# EAGLE board dsp_board_dds_vga (EAGLE 9.6.2), part 1 of 2
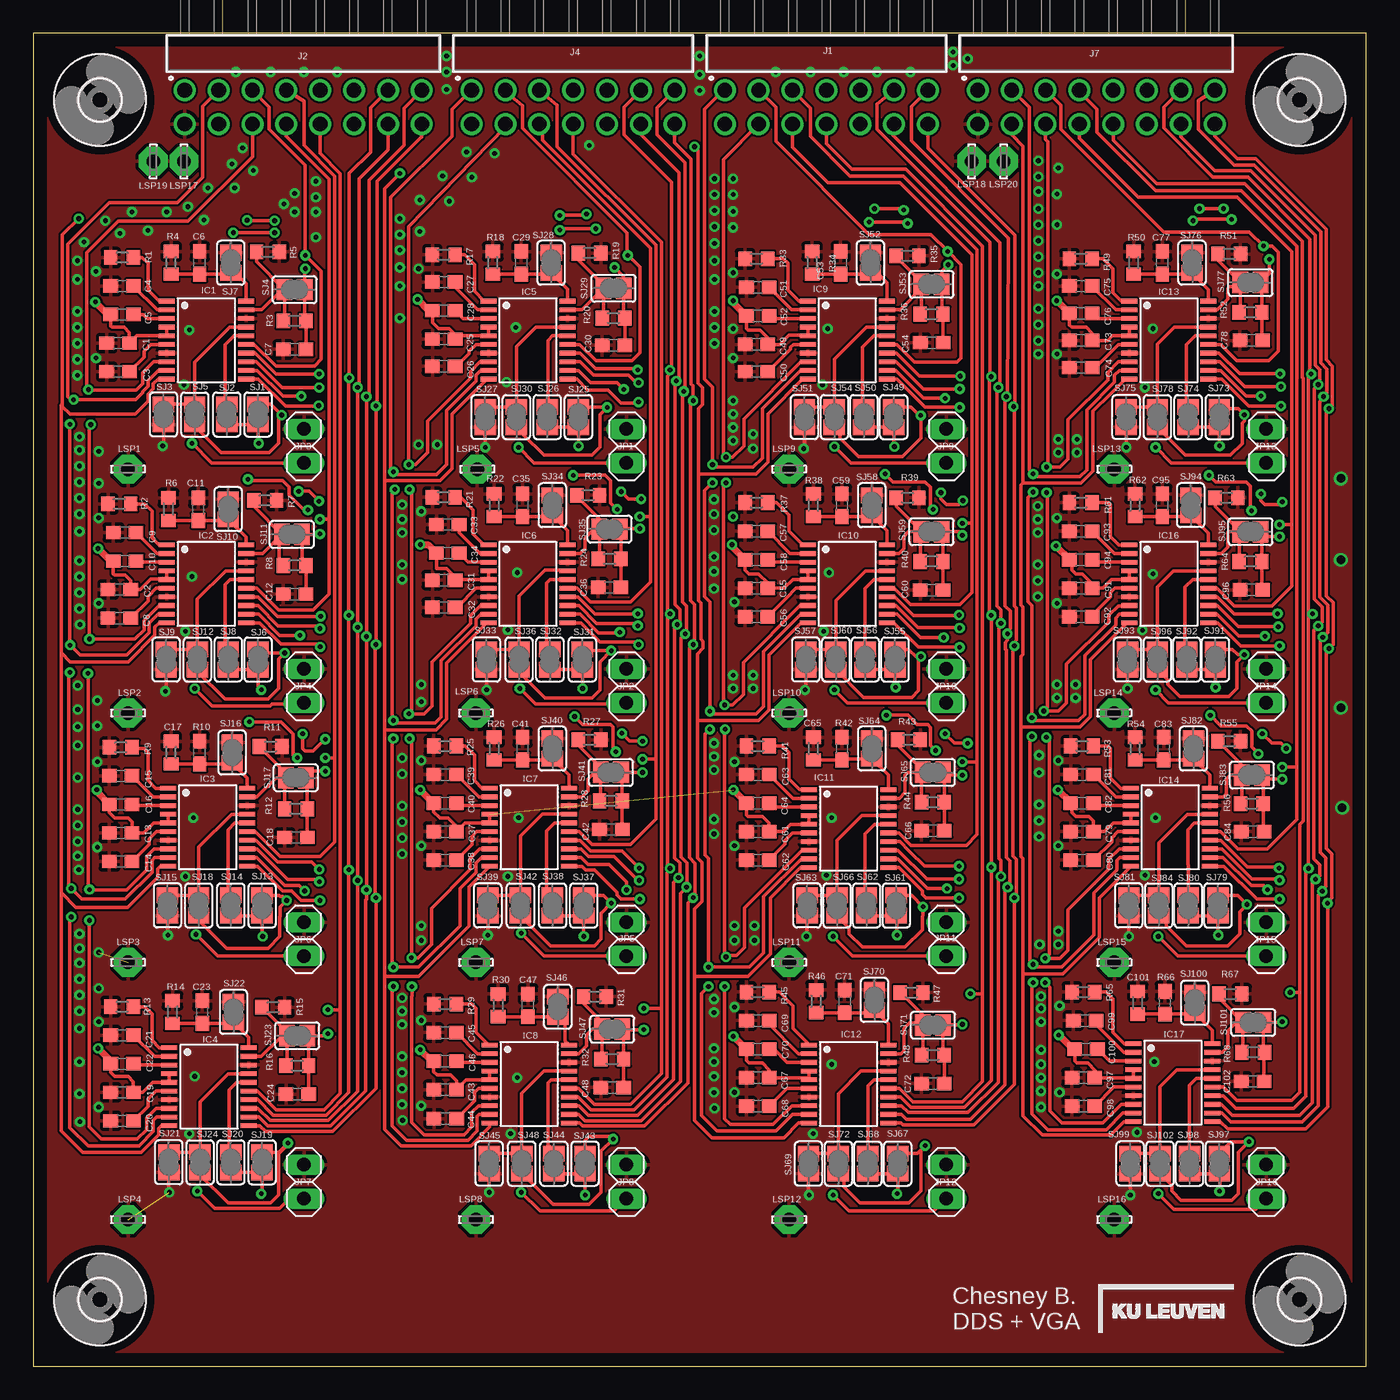
[diagram p8: board, top side]
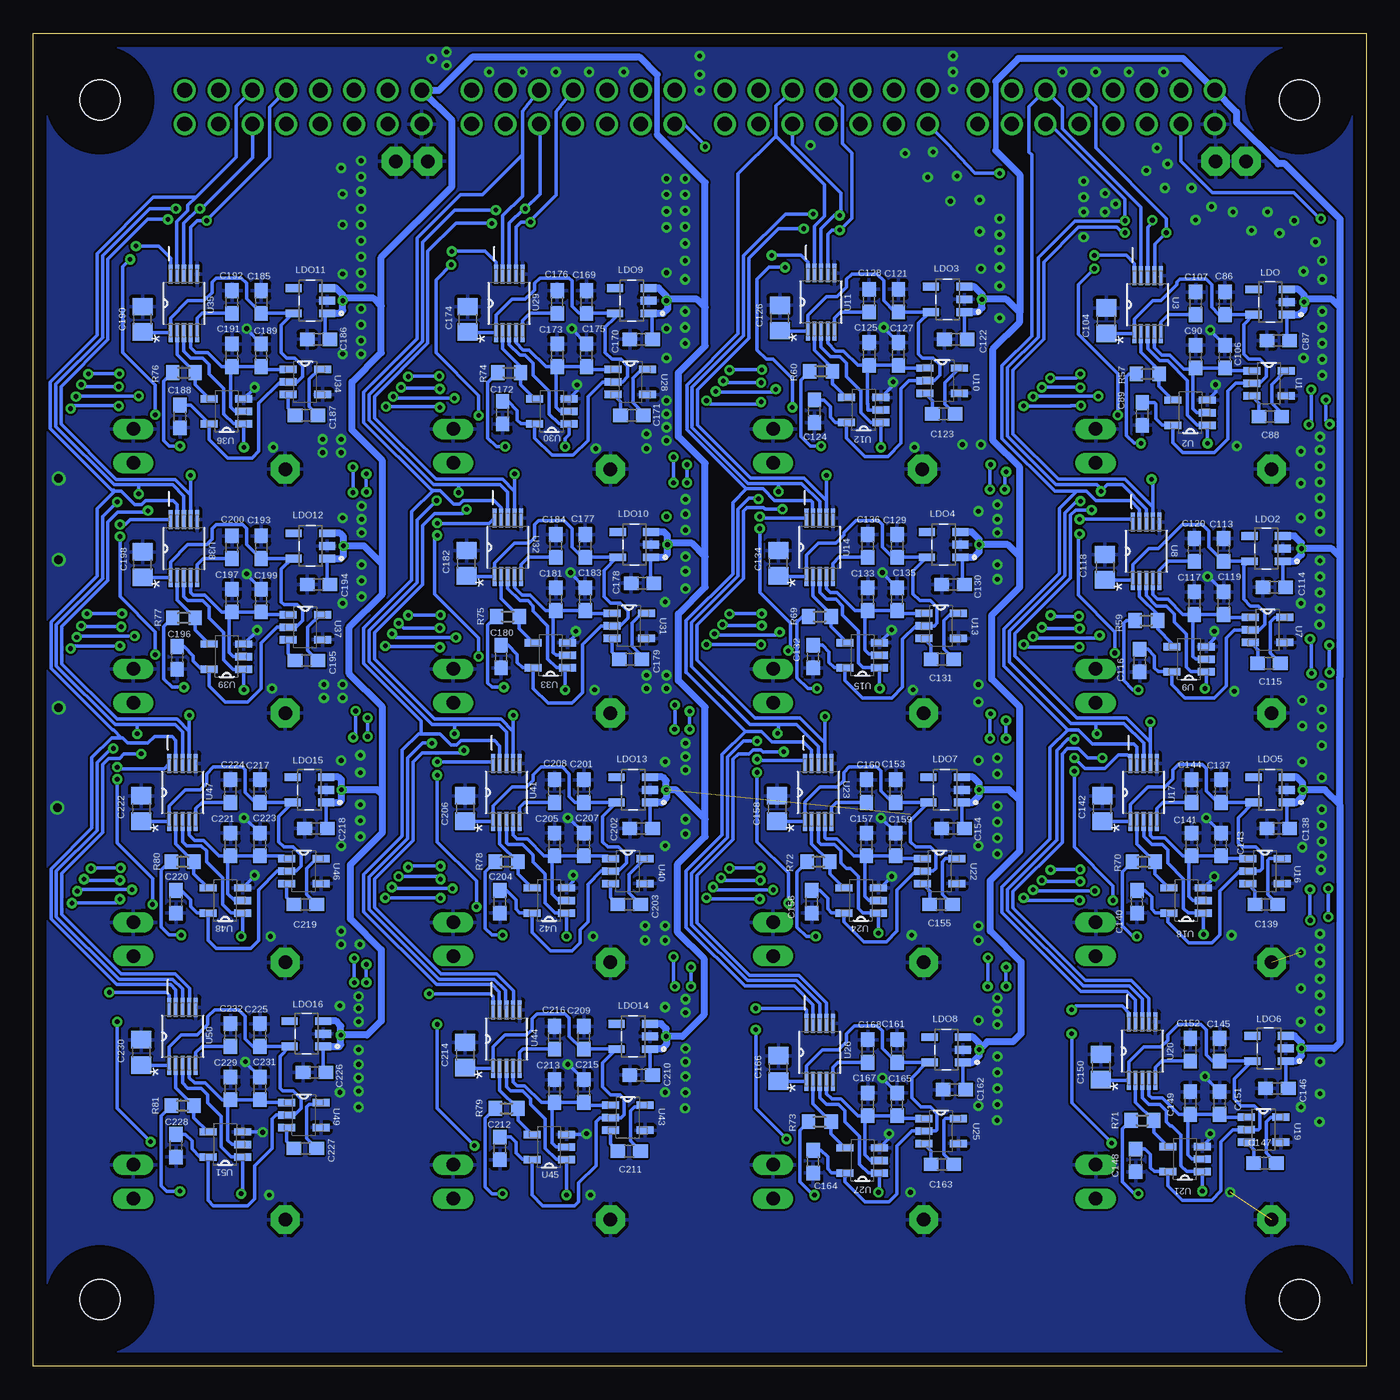
[diagram p9: board, bottom side, seen from below]

Size 100 x 100 mm. Coordinates in mm from the lower left corner, seen from the top.
Outline: 0,0 100,0 100,100 0,100 0,0
Copper layers (1*16): Top 0.035mm / dielectric 1.5mm / Bottom 0.035mm
Design rules "default": minimum track width 6mil, minimum drill 0.35mm, track to track 6mil, track to pad 6mil, pad to pad 6mil, via to via 6mil, smd to smd 6mil, copper to edge 40mil, drill to drill 6mil, minimum pad ring 10mil, minimum via ring 8mil, stop-mask expansion 4mil, vias tented up to drill 0mil, thermal gap 10mil

## Footprints (pad centres in the part's own frame; a part is rotated, then mirrored left to right if it is on the bottom)
C0603 = smd 1.1 x 1: 1 -0.85,0; 2 0.85,0
C0805 = smd 1.3 x 1.5: 1 -0.95,0; 2 0.95,0
3,0 = hole 3: 0,0
TSSOP20 = smd 0.35 x 1.2: 1 -2.275,-2.97; 2 -1.625,-2.97; 3 -0.975,-2.97; 4 -0.325,-2.97; 5 0.325,-2.97; 6 0.975,-2.97; 7 1.625,-2.97; 8 2.275,-2.97; 9 2.925,-2.97; 10 3.575,-2.97; 11 3.575,2.97; 12 2.925,2.97; 13 2.275,2.97; 14 1.625,2.97; 15 0.975,2.97; 16 0.325,2.97; 17 -0.325,2.97; 18 -0.975,2.97; 19 -1.625,2.97; 20 -2.275,2.97
61301421021 = drill 1.1: 1 7.62,2.77; 2 7.62,5.31; 3 5.08,2.77; 4 5.08,5.31; 5 2.54,2.77; 6 2.54,5.31; 7 0,2.77; 8 0,5.31; 9 -2.54,2.77; 10 -2.54,5.31; 11 -5.08,2.77; 12 -5.08,5.31; 13 -7.62,2.77; 14 -7.62,5.31
61301621021 = drill 1.1: 1 8.89,2.77; 2 8.89,5.31; 3 6.35,2.77; 4 6.35,5.31; 5 3.81,2.77; 6 3.81,5.31; 7 1.27,2.77; 8 1.27,5.31; 9 -1.27,2.77; 10 -1.27,5.31; 11 -3.81,2.77; 12 -3.81,5.31; 13 -6.35,2.77; 14 -6.35,5.31; 15 -8.89,2.77; 16 -8.89,5.31
1X02 = drill 1.016 long: 1 -1.27,0; 2 1.27,0
SOT95P280X145-5N = smd 0.59 x 1.21: 1 -0.95,-1.255; 2 0,-1.255; 3 0.95,-1.255; 4 0.95,1.255; 5 -0.95,1.255
LSP10 = drill 1.016 pad 2.159 octagon: MP 0,0
R0603 = smd 1 x 1.1: 1 -0.85,0; 2 0.85,0
SJ = smd 1.168 x 1.6: 1 -0.762,0; 2 0.762,0
SOT95P280X145-5N' = smd 1.27 x 0.559: 1 -1.295,0.94; 2 -1.295,0; 3 -1.295,-0.94; 4 1.295,-0.94; 5 1.295,0.94
SOP50P490X110-10N = smd 1.422 x 0.305: 1 -2.184,0.991; 2 -2.184,0.508; 3 -2.184,0; 4 -2.184,-0.508; 5 -2.184,-0.991; 6 2.184,-0.991; 7 2.184,-0.508; 8 2.184,0; 9 2.184,0.508; 10 2.184,0.991

## Placement (x,y rotation side)
C1  0.1u  [C0603]  6.36,76.76 180 top
C2  0.1u  [C0603]  6.46,58.27 180 top
C3  0.1u  [C0603]  6.36,74.62 180 top
C4  10n  [C0603]  6.66,81.04 180 top
C5  10n  [C0603]  6.66,78.9 180 top
C6  20p  [C0603]  12.48,82.78 90 top
C7  TBD  [C0603]  19.6,76.29 180 top
C8  0.1u  [C0603]  6.46,56.13 180 top
C9  10n  [C0603]  6.86,62.55 180 top
C10  10n  [C0603]  6.86,60.41 180 top
C11  20p  [C0603]  12.38,64.29 90 top
C12  TBD  [C0603]  19.6,57.93 180 top
C13  0.1u  [C0603]  6.56,40.01 180 top
C14  0.1u  [C0603]  6.56,37.87 180 top
C15  10n  [C0603]  6.56,44.29 180 top
C16  10n  [C0603]  6.56,42.15 180 top
C17  20p  [C0603]  12.48,46.03 90 top
C18  TBD  [C0603]  19.7,39.67 180 top
C19  0.1u  [C0603]  6.66,20.55 180 top
C20  0.1u  [C0603]  6.66,18.41 180 top
C21  10n  [C0603]  6.66,24.83 180 top
C22  10n  [C0603]  6.66,22.69 180 top
C23  20p  [C0603]  12.68,26.57 90 top
C24  TBD  [C0603]  19.8,20.41 180 top
C25  0.1u  [C0603]  30.79,77.06 180 top
C26  0.1u  [C0603]  30.79,75.02 180 top
C27  10n  [C0603]  30.79,81.34 180 top
C28  10n  [C0603]  30.79,79.2 180 top
C29  20p  [C0603]  36.61,82.78 90 top
C30  TBD  [C0603]  43.53,76.59 180 top
C31  0.1u  [C0603]  30.79,58.97 180 top
C32  0.1u  [C0603]  30.79,56.93 180 top
C33  10n  [C0603]  31.09,63.15 180 top
C34  10n  [C0603]  31.09,61.01 180 top
C35  20p  [C0603]  36.71,64.59 90 top
C36  TBD  [C0603]  43.23,58.43 180 top
C37  0.1u  [C0603]  30.89,40.11 180 top
C38  0.1u  [C0603]  30.89,37.97 180 top
C39  10n  [C0603]  30.89,44.39 180 top
C40  10n  [C0603]  30.89,42.25 180 top
C41  20p  [C0603]  36.71,46.33 90 top
C42  TBD  [C0603]  43.33,40.27 180 top
C43  0.1u  [C0603]  30.89,20.75 180 top
C44  0.1u  [C0603]  30.91,18.57 180 top
C45  10n  [C0603]  30.89,25.03 180 top
C46  10n  [C0603]  30.89,22.89 180 top
C47  20p  [C0603]  37.11,27.07 90 top
C48  TBD  [C0603]  43.43,20.91 180 top
C49  0.1u  [C0603]  54.25,76.66 180 top
C50  0.1u  [C0603]  54.25,74.62 180 top
C51  10n  [C0603]  54.35,80.94 180 top
C52  10n  [C0603]  54.35,78.8 180 top
C53  20p  [C0603]  60.57,82.78 90 top
C54  TBD  [C0603]  67.41,76.79 180 top
C55  0.1u  [C0603]  54.25,58.37 180 top
C56  0.1u  [C0603]  54.25,56.23 180 top
C57  10n  [C0603]  54.25,62.65 180 top
C58  10n  [C0603]  54.25,60.51 180 top
C59  20p  [C0603]  60.67,64.59 90 top
C60  TBD  [C0603]  67.39,58.23 180 top
C61  0.1u  [C0603]  54.35,40.11 180 top
C62  0.1u  [C0603]  54.35,37.97 180 top
C63  10n  [C0603]  54.35,44.39 180 top
C64  10n  [C0603]  54.35,42.25 180 top
C65  20p  [C0603]  60.67,46.33 90 top
C66  TBD  [C0603]  67.49,40.17 180 top
C67  0.1u  [C0603]  54.35,21.65 180 top
C68  0.1u  [C0603]  54.35,19.51 180 top
C69  10n  [C0603]  54.35,25.93 180 top
C70  10n  [C0603]  54.35,23.79 180 top
C71  20p  [C0603]  60.87,27.37 90 top
C72  TBD  [C0603]  67.49,21.21 180 top
C73  0.1u  [C0603]  78.58,76.96 180 top
C74  0.1u  [C0603]  78.58,74.92 180 top
C75  10n  [C0603]  78.58,81.04 180 top
C76  10n  [C0603]  78.58,79 180 top
C77  20p  [C0603]  84.7,82.78 90 top
C78  TBD  [C0603]  91.38,76.96 180 top
C79  0.1u  [C0603]  78.68,40.11 180 top
C80  0.1u  [C0603]  78.68,37.97 180 top
C81  10n  [C0603]  78.68,44.39 180 top
C82  10n  [C0603]  78.68,42.25 180 top
C83  20p  [C0603]  84.8,46.33 90 top
C84  TBD  [C0603]  91.48,40.11 180 top
C86  0.1u  [C0603]  10.6,79.74 270 bottom
C87  1u  [C0603]  6.6,76.94 0 bottom
C88  1u  [C0603]  7.2,71.24 0 bottom
C89  1u  [C0603]  16.8,71.44 90 bottom
C90  1u  [C0603]  12.8,75.74 270 bottom
C91  0.1u  [C0603]  78.58,58.37 180 top
C92  0.1u  [C0603]  78.58,56.23 180 top
C93  10n  [C0603]  78.58,62.65 180 top
C94  10n  [C0603]  78.58,60.51 180 top
C95  20p  [C0603]  84.7,64.59 90 top
C96  TBD  [C0603]  91.38,58.25 180 top
C97  0.1u  [C0603]  78.78,21.65 180 top
C98  0.1u  [C0603]  78.78,19.51 180 top
C99  10n  [C0603]  78.88,25.93 180 top
C100  10n  [C0603]  78.98,23.79 180 top
C101  20p  [C0603]  84.9,27.27 90 top
C102  TBD  [C0603]  91.48,21.37 180 top
C104  10u  [C0805]  19.5,78.44 90 bottom
C106  0.1u  [C0603]  10.6,75.74 90 bottom
C107  1u  [C0603]  12.8,79.74 90 bottom
C113  0.1u  [C0603]  10.7,61.24 270 bottom
C114  1u  [C0603]  6.9,58.44 0 bottom
C115  1u  [C0603]  7.3,52.74 0 bottom
C116  1u  [C0603]  17,52.94 90 bottom
C117  1u  [C0603]  12.9,57.24 270 bottom
C118  10u  [C0805]  19.6,59.94 90 bottom
C119  0.1u  [C0603]  10.7,57.24 90 bottom
C120  1u  [C0603]  12.9,61.24 90 bottom
C121  0.1u  [C0603]  35.1,79.94 270 bottom
C122  1u  [C0603]  30.8,77.04 0 bottom
C123  1u  [C0603]  31.7,71.44 0 bottom
C124  1u  [C0603]  41.4,71.64 90 bottom
C125  1u  [C0603]  37.3,75.94 270 bottom
C126  10u  [C0805]  44,78.64 90 bottom
C127  0.1u  [C0603]  35.1,75.94 90 bottom
C128  1u  [C0603]  37.3,79.94 90 bottom
C129  0.1u  [C0603]  35.2,61.54 270 bottom
C130  1u  [C0603]  31,58.64 0 bottom
C131  1u  [C0603]  31.8,53.04 0 bottom
C132  1u  [C0603]  41.5,53.24 90 bottom
C133  1u  [C0603]  37.4,57.54 270 bottom
C134  10u  [C0805]  44.1,60.24 90 bottom
C135  0.1u  [C0603]  35.2,57.54 90 bottom
C136  1u  [C0603]  37.4,61.54 90 bottom
C137  0.1u  [C0603]  10.9,43.14 270 bottom
C138  1u  [C0603]  6.6,40.34 0 bottom
C139  1u  [C0603]  7.5,34.64 0 bottom
C140  1u  [C0603]  17.2,34.84 90 bottom
C141  1u  [C0603]  13.1,39.14 270 bottom
C142  10u  [C0805]  19.8,41.84 90 bottom
C143  0.1u  [C0603]  10.9,39.14 90 bottom
C144  1u  [C0603]  13.1,43.14 90 bottom
C145  0.1u  [C0603]  11,23.74 270 bottom
C146  1u  [C0603]  6.7,20.84 0 bottom
C147  1u  [C0603]  7.6,15.24 0 bottom
C148  1u  [C0603]  17.3,15.44 90 bottom
C149  1u  [C0603]  13.2,19.74 270 bottom
C150  10u  [C0805]  19.9,22.44 90 bottom
C151  0.1u  [C0603]  11,19.74 90 bottom
C152  1u  [C0603]  13.2,23.74 90 bottom
C153  0.1u  [C0603]  35.3,43.14 270 bottom
C154  1u  [C0603]  31,40.34 0 bottom
C155  1u  [C0603]  31.9,34.64 0 bottom
C156  1u  [C0603]  41.6,34.84 90 bottom
C157  1u  [C0603]  37.5,39.14 270 bottom
C158  10u  [C0805]  44.2,41.84 90 bottom
C159  0.1u  [C0603]  35.3,39.14 90 bottom
C160  1u  [C0603]  37.5,43.14 90 bottom
C161  0.1u  [C0603]  35.2,23.64 270 bottom
C162  1u  [C0603]  30.9,20.74 0 bottom
C163  1u  [C0603]  31.8,15.14 0 bottom
C164  1u  [C0603]  41.5,15.34 90 bottom
C165  1u  [C0603]  37.4,19.64 270 bottom
C166  10u  [C0805]  44.1,22.34 90 bottom
C167  0.1u  [C0603]  35.2,19.64 90 bottom
C168  1u  [C0603]  37.4,23.64 90 bottom
C169  0.1u  [C0603]  58.5,79.84 270 bottom
C170  1u  [C0603]  54.4,77.04 0 bottom
C171  1u  [C0603]  55.1,71.34 0 bottom
C172  1u  [C0603]  64.8,71.54 90 bottom
C173  1u  [C0603]  60.7,75.84 270 bottom
C174  10u  [C0805]  67.4,78.54 90 bottom
C175  0.1u  [C0603]  58.5,75.84 90 bottom
C176  1u  [C0603]  60.7,79.84 90 bottom
C177  0.1u  [C0603]  58.6,61.54 270 bottom
C178  1u  [C0603]  54.3,58.74 0 bottom
C179  1u  [C0603]  55.2,53.04 0 bottom
C180  1u  [C0603]  64.9,53.24 90 bottom
C181  1u  [C0603]  60.8,57.54 270 bottom
C182  10u  [C0805]  67.5,60.24 90 bottom
C183  0.1u  [C0603]  58.6,57.54 90 bottom
C184  1u  [C0603]  60.8,61.54 90 bottom
C185  0.1u  [C0603]  82.9,79.84 270 bottom
C186  1u  [C0603]  78.6,77.04 0 bottom
C187  1u  [C0603]  79.5,71.34 0 bottom
C188  1u  [C0603]  89,71.26 90 bottom
C189  1u  [C0603]  85.1,75.84 270 bottom
C190  10u  [C0805]  91.8,78.54 90 bottom
C191  0.1u  [C0603]  82.9,75.84 90 bottom
C192  1u  [C0603]  85.1,79.84 90 bottom
C193  0.1u  [C0603]  82.9,61.44 270 bottom
C194  1u  [C0603]  78.6,58.64 0 bottom
C195  1u  [C0603]  79.5,52.94 0 bottom
C196  1u  [C0603]  89.2,53.14 90 bottom
C197  1u  [C0603]  85.1,57.44 270 bottom
C198  10u  [C0805]  91.8,60.14 90 bottom
C199  0.1u  [C0603]  82.9,57.44 90 bottom
C200  1u  [C0603]  85.1,61.44 90 bottom
C201  0.1u  [C0603]  58.7,43.14 270 bottom
C202  1u  [C0603]  54.4,40.34 0 bottom
C203  1u  [C0603]  55.3,34.64 0 bottom
C204  1u  [C0603]  65,34.84 90 bottom
C205  1u  [C0603]  60.9,39.14 270 bottom
C206  10u  [C0805]  67.6,41.84 90 bottom
C207  0.1u  [C0603]  58.7,39.14 90 bottom
C208  1u  [C0603]  60.9,43.14 90 bottom
C209  0.1u  [C0603]  58.7,24.64 270 bottom
C210  1u  [C0603]  54.4,21.84 0 bottom
C211  1u  [C0603]  55.3,16.14 0 bottom
C212  1u  [C0603]  65,16.34 90 bottom
C213  1u  [C0603]  60.9,20.64 270 bottom
C214  10u  [C0805]  67.6,23.34 90 bottom
C215  0.1u  [C0603]  58.7,20.64 90 bottom
C216  1u  [C0603]  60.9,24.64 90 bottom
C217  0.1u  [C0603]  83,43.14 270 bottom
C218  1u  [C0603]  78.8,40.34 0 bottom
C219  1u  [C0603]  79.6,34.64 0 bottom
C220  1u  [C0603]  89.3,34.84 90 bottom
C221  1u  [C0603]  85.2,39.14 270 bottom
C222  10u  [C0805]  91.9,41.84 90 bottom
C223  0.1u  [C0603]  83,39.14 90 bottom
C224  1u  [C0603]  85.2,43.14 90 bottom
C225  0.1u  [C0603]  83,24.84 270 bottom
C226  1u  [C0603]  78.9,22.04 0 bottom
C227  1u  [C0603]  79.6,16.34 0 bottom
C228  1u  [C0603]  89.3,16.54 90 bottom
C229  1u  [C0603]  85.2,20.84 270 bottom
C230  10u  [C0805]  91.9,23.54 90 bottom
C231  0.1u  [C0603]  83,20.84 90 bottom
C232  1u  [C0603]  85.2,24.84 90 bottom
H1  MOUNT-HOLE3.0  [3,0]  95,5 0 top
H2  MOUNT-HOLE3.0  [3,0]  5,5 0 top
H3  MOUNT-HOLE3.0  [3,0]  5,95 0 top
H4  MOUNT-HOLE3.0  [3,0]  95,95 0 top
IC1  AD9834  [TSSOP20]  12.98,77.63 270 top
IC2  AD9834  [TSSOP20]  12.98,59.34 270 top
IC3  AD9834  [TSSOP20]  13.08,41.08 270 top
IC4  AD9834  [TSSOP20]  13.18,21.62 270 top
IC5  AD9834  [TSSOP20]  37.11,77.63 270 top
IC6  AD9834  [TSSOP20]  37.11,59.34 270 top
IC7  AD9834  [TSSOP20]  37.21,41.08 270 top
IC8  AD9834  [TSSOP20]  37.21,21.82 270 top
IC9  AD9834  [TSSOP20]  61.07,77.63 270 top
IC10  AD9834  [TSSOP20]  61.07,59.34 270 top
IC11  AD9834  [TSSOP20]  61.17,40.98 270 top
IC12  AD9834  [TSSOP20]  61.17,21.82 270 top
IC13  AD9834  [TSSOP20]  85.2,77.63 270 top
IC14  AD9834  [TSSOP20]  85.3,41.08 270 top
IC16  AD9834  [TSSOP20]  85.2,59.34 270 top
IC17  AD9834  [TSSOP20]  85.5,21.92 270 top
J1  [61301421021]  59.5,98.5 180 top
J2  [61301621021]  20.25,98.5 180 top
J4  [61301421021]  40.5,98.5 180 top
J7  [61301621021]  79.75,98.5 180 top
JP1  [1X02]  44.5,69.04 90 top
JP2  [1X02]  44.5,51.04 90 top
JP3  [1X02]  20.3,69.04 90 top
JP4  [1X02]  20.3,51.04 90 top
JP5  [1X02]  44.5,32.04 90 top
JP6  [1X02]  20.3,32.04 90 top
JP7  [1X02]  20.3,13.84 90 top
JP8  [1X02]  44.5,13.84 90 top
JP9  [1X02]  68.5,69.04 90 top
JP10  [1X02]  68.5,51.04 90 top
JP11  [1X02]  68.5,32.04 90 top
JP12  [1X02]  68.5,13.84 90 top
JP13  [1X02]  92.5,69.04 90 top
JP14  [1X02]  92.5,51.04 90 top
JP15  [1X02]  92.5,32.04 90 top
JP16  [1X02]  92.5,13.84 90 top
LDO  TLV75525PDBVR  [SOT95P280X145-5N]  7.2,79.84 90 bottom
LDO2  TLV75525PDBVR  [SOT95P280X145-5N]  7.5,61.34 90 bottom
LDO3  TLV75525PDBVR  [SOT95P280X145-5N]  31.4,80.04 90 bottom
LDO4  TLV75525PDBVR  [SOT95P280X145-5N]  31.7,61.64 90 bottom
LDO5  TLV75525PDBVR  [SOT95P280X145-5N]  7.2,43.24 90 bottom
LDO6  TLV75525PDBVR  [SOT95P280X145-5N]  7.3,23.84 90 bottom
LDO7  TLV75525PDBVR  [SOT95P280X145-5N]  31.6,43.24 90 bottom
LDO8  TLV75525PDBVR  [SOT95P280X145-5N]  31.5,23.74 90 bottom
LDO9  TLV75525PDBVR  [SOT95P280X145-5N]  55.1,79.94 90 bottom
LDO10  TLV75525PDBVR  [SOT95P280X145-5N]  54.9,61.64 90 bottom
LDO11  TLV75525PDBVR  [SOT95P280X145-5N]  79.2,79.94 90 bottom
LDO12  TLV75525PDBVR  [SOT95P280X145-5N]  79.2,61.54 90 bottom
LDO13  TLV75525PDBVR  [SOT95P280X145-5N]  55,43.24 90 bottom
LDO14  TLV75525PDBVR  [SOT95P280X145-5N]  55,24.74 90 bottom
LDO15  TLV75525PDBVR  [SOT95P280X145-5N]  79.3,43.24 90 bottom
LDO16  TLV75525PDBVR  [SOT95P280X145-5N]  79.5,24.94 90 bottom
LSP1  LSP10  [LSP10]  7.1,67.3 0 top
LSP2  LSP10  [LSP10]  7.1,49 0 top
LSP3  LSP10  [LSP10]  7.1,30.3 0 top
LSP4  LSP10  [LSP10]  7.1,11 0 top
LSP5  LSP10  [LSP10]  33.3,67.3 0 top
LSP6  LSP10  [LSP10]  33.2,49 0 top
LSP7  LSP10  [LSP10]  33.2,30.3 0 top
LSP8  LSP10  [LSP10]  33.2,11 0 top
LSP9  LSP10  [LSP10]  56.7,67.3 0 top
LSP10  LSP10  [LSP10]  56.7,49 0 top
LSP11  LSP10  [LSP10]  56.7,30.3 0 top
LSP12  LSP10  [LSP10]  56.7,11 0 top
LSP13  LSP10  [LSP10]  81.1,67.3 0 top
LSP14  LSP10  [LSP10]  81.1,49 0 top
LSP15  LSP10  [LSP10]  81.1,30.3 0 top
LSP16  LSP10  [LSP10]  81.1,11 0 top
LSP17  LSP10  [LSP10]  11.3,90.4 90 top
LSP18  LSP10  [LSP10]  70.4,90.4 90 top
LSP19  LSP10  [LSP10]  9,90.4 90 top
LSP20  LSP10  [LSP10]  72.8,90.4 90 top
R1  6.8k  [R0603]  6.66,83.18 180 top
R2  6.8k  [R0603]  6.46,64.69 180 top
R3  TBD  [R0603]  19.6,78.43 0 top
R4  200  [R0603]  10.34,82.78 270 top
R5  200  [R0603]  17.6,83.61 180 top
R6  200  [R0603]  10.14,64.29 270 top
R7  200  [R0603]  17.4,64.95 180 top
R8  TBD  [R0603]  19.6,60.07 0 top
R9  6.8k  [R0603]  6.56,46.43 180 top
R10  200  [R0603]  10.34,46.03 270 top
R11  200  [R0603]  17.8,46.49 180 top
R12  TBD  [R0603]  19.7,41.81 0 top
R13  6.8k  [R0603]  6.66,26.97 180 top
R14  200  [R0603]  10.44,26.57 270 top
R15  200  [R0603]  18,26.93 180 top
R16  TBD  [R0603]  19.8,22.55 0 top
R17  6.8k  [R0603]  30.79,83.38 180 top
R18  200  [R0603]  34.47,82.78 270 top
R19  200  [R0603]  41.73,83.51 180 top
R20  TBD  [R0603]  43.53,78.63 0 top
R21  6.8k  [R0603]  30.79,65.19 180 top
R22  200  [R0603]  34.57,64.59 270 top
R23  200  [R0603]  41.63,65.35 180 top
R24  TBD  [R0603]  43.23,60.57 0 top
R25  6.8k  [R0603]  30.89,46.53 180 top
R26  200  [R0603]  34.57,46.33 270 top
R27  200  [R0603]  41.73,46.99 180 top
R28  TBD  [R0603]  43.33,42.41 0 top
R29  6.8k  [R0603]  30.89,27.17 180 top
R30  200  [R0603]  34.87,27.07 270 top
R31  200  [R0603]  42.13,27.73 180 top
R32  TBD  [R0603]  43.43,23.05 0 top
R33  6.8k  [R0603]  54.25,83.08 180 top
R34  200  [R0603]  58.43,82.78 270 top
R35  200  [R0603]  65.59,83.31 180 top
R36  TBD  [R0603]  67.39,78.93 0 top
R37  6.8k  [R0603]  54.25,64.79 180 top
R38  200  [R0603]  58.53,64.59 270 top
R39  200  [R0603]  65.59,65.15 180 top
R40  TBD  [R0603]  67.39,60.37 0 top
R41  6.8k  [R0603]  54.35,46.53 180 top
R42  200  [R0603]  58.53,46.33 270 top
R43  200  [R0603]  65.69,46.99 180 top
R44  TBD  [R0603]  67.49,42.31 0 top
R45  6.8k  [R0603]  54.35,28.07 180 top
R46  200  [R0603]  58.73,27.37 270 top
R47  200  [R0603]  65.89,28.03 180 top
R48  TBD  [R0603]  67.49,23.35 0 top
R49  6.8k  [R0603]  78.58,83.08 180 top
R50  200  [R0603]  82.56,82.78 270 top
R51  200  [R0603]  89.72,83.44 180 top
R52  TBD  [R0603]  91.32,79.06 0 top
R53  6.8k  [R0603]  78.68,46.53 180 top
R54  200  [R0603]  82.66,46.33 270 top
R55  200  [R0603]  89.72,46.89 180 top
R56  TBD  [R0603]  91.42,42.21 0 top
R57  [R0603]  16.4,74.44 0 bottom
R59  [R0603]  16.5,55.94 0 bottom
R60  [R0603]  40.9,74.64 0 bottom
R61  6.8k  [R0603]  78.58,64.79 180 top
R62  200  [R0603]  82.66,64.59 270 top
R63  200  [R0603]  89.52,65.15 180 top
R64  TBD  [R0603]  91.32,60.37 0 top
R65  6.8k  [R0603]  78.78,28.07 180 top
R66  200  [R0603]  82.86,27.27 270 top
R67  200  [R0603]  89.82,27.93 180 top
R68  TBD  [R0603]  91.52,23.55 0 top
R69  [R0603]  41,56.24 0 bottom
R70  [R0603]  16.7,37.84 0 bottom
R71  [R0603]  16.8,18.44 0 bottom
R72  [R0603]  41.1,37.84 0 bottom
R73  [R0603]  41,18.34 0 bottom
R74  [R0603]  64.3,74.54 0 bottom
R75  [R0603]  64.4,56.24 0 bottom
R76  [R0603]  88.7,74.54 0 bottom
R77  [R0603]  88.7,56.14 0 bottom
R78  [R0603]  64.5,37.84 0 bottom
R79  [R0603]  64.5,19.34 0 bottom
R80  [R0603]  88.8,37.84 0 bottom
R81  [R0603]  88.8,19.54 0 bottom
SJ1  [SJ]  16.86,71.41 270 top
SJ2  [SJ]  14.52,71.41 270 top
SJ3  [SJ]  9.77,71.41 90 top
SJ4  [SJ]  19.6,80.77 0 top
SJ5  [SJ]  12.11,71.41 270 top
SJ6  [SJ]  16.86,53.02 270 top
SJ7  [SJ]  14.82,82.78 90 top
SJ8  [SJ]  14.62,53.02 270 top
SJ9  [SJ]  9.97,53.02 90 top
SJ10  [SJ]  14.62,64.29 90 top
SJ11  [SJ]  19.4,62.41 0 top
SJ12  [SJ]  12.31,53.02 270 top
SJ13  [SJ]  17.16,34.56 270 top
SJ14  [SJ]  14.82,34.56 270 top
SJ15  [SJ]  10.07,34.56 90 top
SJ16  [SJ]  14.92,46.03 90 top
SJ17  [SJ]  19.7,44.15 0 top
SJ18  [SJ]  12.41,34.56 270 top
SJ19  [SJ]  17.16,15.3 270 top
SJ20  [SJ]  14.82,15.3 270 top
SJ21  [SJ]  10.17,15.3 90 top
SJ22  [SJ]  15.02,26.57 90 top
SJ23  [SJ]  19.8,24.79 0 top
SJ24  [SJ]  12.51,15.3 270 top
SJ25  [SJ]  40.89,71.21 270 top
SJ26  [SJ]  38.55,71.21 270 top
SJ27  [SJ]  33.9,71.21 90 top
SJ28  [SJ]  38.85,82.78 90 top
SJ29  [SJ]  43.53,80.87 0 top
SJ30  [SJ]  36.24,71.21 270 top
SJ31  [SJ]  41.19,53.02 270 top
SJ32  [SJ]  38.75,53.02 270 top
SJ33  [SJ]  34,53.02 90 top
SJ34  [SJ]  38.95,64.59 90 top
SJ35  [SJ]  43.23,62.81 0 top
SJ36  [SJ]  36.44,53.02 270 top
SJ37  [SJ]  41.29,34.56 270 top
SJ38  [SJ]  38.95,34.56 270 top
SJ39  [SJ]  34.1,34.56 90 top
SJ40  [SJ]  38.95,46.33 90 top
SJ41  [SJ]  43.33,44.55 0 top
SJ42  [SJ]  36.54,34.56 270 top
SJ43  [SJ]  41.39,15.2 270 top
SJ44  [SJ]  39.05,15.2 270 top
SJ45  [SJ]  34.2,15.2 90 top
SJ46  [SJ]  39.35,26.97 90 top
SJ47  [SJ]  43.43,25.29 0 top
SJ48  [SJ]  36.64,15.2 270 top
SJ49  [SJ]  64.55,71.21 270 top
SJ50  [SJ]  62.31,71.21 270 top
SJ51  [SJ]  57.86,71.21 90 top
SJ52  [SJ]  62.81,82.78 90 top
SJ53  [SJ]  67.39,81.17 0 top
SJ54  [SJ]  60.1,71.21 270 top
SJ55  [SJ]  64.65,53.02 270 top
SJ56  [SJ]  62.41,53.02 270 top
SJ57  [SJ]  57.96,53.02 90 top
SJ58  [SJ]  62.91,64.59 90 top
SJ59  [SJ]  67.39,62.61 0 top
SJ60  [SJ]  60.2,53.02 270 top
SJ61  [SJ]  64.75,34.56 270 top
SJ62  [SJ]  62.51,34.56 270 top
SJ63  [SJ]  58.06,34.56 90 top
SJ64  [SJ]  62.91,46.33 90 top
SJ65  [SJ]  67.49,44.55 0 top
SJ66  [SJ]  60.3,34.56 270 top
SJ67  [SJ]  64.85,15.2 270 top
SJ68  [SJ]  62.61,15.2 270 top
SJ69  [SJ]  58.16,15.2 90 top
SJ70  [SJ]  63.11,27.47 90 top
SJ71  [SJ]  67.49,25.59 0 top
SJ72  [SJ]  60.4,15.2 270 top
SJ73  [SJ]  88.98,71.21 270 top
SJ74  [SJ]  86.64,71.21 270 top
SJ75  [SJ]  81.99,71.21 90 top
SJ76  [SJ]  86.94,82.78 90 top
SJ77  [SJ]  91.32,81.3 0 top
SJ78  [SJ]  84.33,71.21 270 top
SJ79  [SJ]  88.88,34.56 270 top
SJ80  [SJ]  86.64,34.56 270 top
SJ81  [SJ]  82.19,34.56 90 top
SJ82  [SJ]  87.04,46.33 90 top
SJ83  [SJ]  91.42,44.35 0 top
SJ84  [SJ]  84.43,34.56 270 top
SJ91  [SJ]  88.68,53.02 270 top
SJ92  [SJ]  86.54,53.02 270 top
SJ93  [SJ]  82.09,53.02 90 top
SJ94  [SJ]  86.84,64.59 90 top
SJ95  [SJ]  91.32,62.61 0 top
SJ96  [SJ]  84.33,53.02 270 top
SJ97  [SJ]  88.98,15.2 270 top
SJ98  [SJ]  86.74,15.2 270 top
SJ99  [SJ]  82.29,15.2 90 top
SJ100  [SJ]  87.14,27.27 90 top
SJ101  [SJ]  91.52,25.79 0 top
SJ102  [SJ]  84.53,15.2 270 top
U1  TPS60400DBVT  [SOT95P280X145-5N']  7.3,73.74 0 bottom
U2  TLV271CDBVR  [SOT95P280X145-5N']  13.2,71.54 180 bottom
U3  AD5270BRMZ-50  [SOP50P490X110-10N]  16.4,79.64 90 bottom
U7  TPS60400DBVT  [SOT95P280X145-5N']  7.4,55.24 0 bottom
U8  AD5270BRMZ-50  [SOP50P490X110-10N]  16.5,61.14 90 bottom
U9  TLV271CDBVR  [SOT95P280X145-5N']  13.3,53.04 180 bottom
U10  TPS60400DBVT  [SOT95P280X145-5N']  31.8,73.94 0 bottom
U11  AD5270BRMZ-50  [SOP50P490X110-10N]  40.9,79.84 90 bottom
U12  TLV271CDBVR  [SOT95P280X145-5N']  37.7,71.74 180 bottom
U13  TPS60400DBVT  [SOT95P280X145-5N']  31.9,55.54 0 bottom
U14  AD5270BRMZ-50  [SOP50P490X110-10N]  41,61.44 90 bottom
U15  TLV271CDBVR  [SOT95P280X145-5N']  37.8,53.34 180 bottom
U16  TPS60400DBVT  [SOT95P280X145-5N']  7.6,37.14 0 bottom
U17  AD5270BRMZ-50  [SOP50P490X110-10N]  16.7,43.04 90 bottom
U18  TLV271CDBVR  [SOT95P280X145-5N']  13.5,34.94 180 bottom
U19  TPS60400DBVT  [SOT95P280X145-5N']  7.7,17.74 0 bottom
U20  AD5270BRMZ-50  [SOP50P490X110-10N]  16.8,23.64 90 bottom
U21  TLV271CDBVR  [SOT95P280X145-5N']  13.6,15.54 180 bottom
U22  TPS60400DBVT  [SOT95P280X145-5N']  32,37.14 0 bottom
U23  AD5270BRMZ-50  [SOP50P490X110-10N]  41.1,43.04 90 bottom
U24  TLV271CDBVR  [SOT95P280X145-5N']  37.9,34.94 180 bottom
U25  TPS60400DBVT  [SOT95P280X145-5N']  31.9,17.64 0 bottom
U26  AD5270BRMZ-50  [SOP50P490X110-10N]  41,23.54 90 bottom
U27  TLV271CDBVR  [SOT95P280X145-5N']  37.8,15.44 180 bottom
U28  TPS60400DBVT  [SOT95P280X145-5N']  55.2,73.84 0 bottom
U29  AD5270BRMZ-50  [SOP50P490X110-10N]  64.3,79.74 90 bottom
U30  TLV271CDBVR  [SOT95P280X145-5N']  61.1,71.64 180 bottom
U31  TPS60400DBVT  [SOT95P280X145-5N']  55.3,55.54 0 bottom
U32  AD5270BRMZ-50  [SOP50P490X110-10N]  64.4,61.44 90 bottom
U33  TLV271CDBVR  [SOT95P280X145-5N']  61.2,53.34 180 bottom
U34  TPS60400DBVT  [SOT95P280X145-5N']  79.6,73.84 0 bottom
U35  AD5270BRMZ-50  [SOP50P490X110-10N]  88.7,79.74 90 bottom
U36  TLV271CDBVR  [SOT95P280X145-5N']  85.5,71.64 180 bottom
U37  TPS60400DBVT  [SOT95P280X145-5N']  79.6,55.44 0 bottom
U38  AD5270BRMZ-50  [SOP50P490X110-10N]  88.7,61.34 90 bottom
U39  TLV271CDBVR  [SOT95P280X145-5N']  85.5,53.24 180 bottom
U40  TPS60400DBVT  [SOT95P280X145-5N']  55.4,37.14 0 bottom
U41  AD5270BRMZ-50  [SOP50P490X110-10N]  64.5,43.04 90 bottom
U42  TLV271CDBVR  [SOT95P280X145-5N']  61.3,34.94 180 bottom
U43  TPS60400DBVT  [SOT95P280X145-5N']  55.4,18.64 0 bottom
U44  AD5270BRMZ-50  [SOP50P490X110-10N]  64.5,24.54 90 bottom
U45  TLV271CDBVR  [SOT95P280X145-5N']  61.3,16.44 180 bottom
U46  TPS60400DBVT  [SOT95P280X145-5N']  79.7,37.14 0 bottom
U47  AD5270BRMZ-50  [SOP50P490X110-10N]  88.8,43.04 90 bottom
U48  TLV271CDBVR  [SOT95P280X145-5N']  85.6,34.94 180 bottom
U49  TPS60400DBVT  [SOT95P280X145-5N']  79.7,18.84 0 bottom
U50  AD5270BRMZ-50  [SOP50P490X110-10N]  88.8,24.74 90 bottom
U51  TLV271CDBVR  [SOT95P280X145-5N']  85.6,16.64 180 bottom

## Tracks (layer width: path | path; a pad name or v marks a point on that pad's centre or on a via)
2.5V_1
  Bottom 0.254: C104.1 19.47,77.46 U3.1 17.39,78.55 16,79.94 15.4,79.94 14.2,81.14 14.2,81.34 14,81.54 12,81.54 11.6,81.14 11.6,79.44 11.05,78.89 C86.2 LDO.5 9.2,78.14 9.2,75.94 8.8,75.54 8,75.54 7.5,75.04 7.5,74.24 8,73.74 U1.2 9.8,73.74 10.4,73.14 10.4,69.54 11.4,68.54 13.76,68.54 14.49,69.28 U2.5 15.3,70.6 15.8,71.1 15.8,72.2 15.89,72.29 C89.2
2.5V_2
  Bottom 0.254: C118.1 17.52,58.99 U8.1 17.49,60.15 16.3,61.34 15.6,61.34 13.8,63.14 12.3,63.14 11.8,62.64 11.8,61.44 10.75,60.39 C113.2 LDO2.5 8.85,60.39 9.2,60.04 9.2,57.54 8.7,57.04 8.1,57.04 7.61,56.55 7.61,55.64 8.01,55.24 U7.2 9.9,55.24 10.5,54.64 10.5,51.04 11.4,50.14 13.6,50.14 14.6,51.13 U9.5 15.6,52.1 15.9,52.4 15.9,53.3 16.39,53.79 C116.2
2.5V_3
  Bottom 0.254: C142.1 19.77,40.86 U17.1 17.69,42.15 16.4,43.44 15.1,43.44 14.5,44.04 14.5,44.74 14.1,45.14 12.3,45.14 12,44.84 12,43.14 11.15,42.29 C137.2 LDO5.5 9.6,41.15 9.6,39.24 9.3,38.94 8.3,38.94 7.8,38.44 7.8,38.12 7.81,38.11 7.81,37.33 8,37.14 U16.2 9.5,37.14 11,35.64 11,32.34 11.6,31.74 13.3,31.74 14.9,33.34 14.9,34 U18.5 15.8,34 16.1,34.3 16.1,35.2 16.59,35.69 C140.2
2.5V_4
  Bottom 0.254: C150.1 19.87,21.46 U20.1 17.79,22.85 16.7,23.94 15.4,23.94 14.9,24.44 14.9,24.84 14.1,25.64 12.4,25.64 12,25.24 12,23.34 11.55,22.89 C145.2 LDO6.5 9.9,21.55 9.9,20.04 9.4,19.54 8.4,19.54 8,19.14 8,17.84 8.1,17.74 U19.2 10,17.74 10.9,16.84 10.9,13.14 11.6,12.44 13.8,12.44 14.89,13.54 U21.5 15.9,14.6 16.2,14.9 16.2,15.9 16.59,16.29 C148.2
2.5V_5
  Bottom 0.254: C126.1 43.97,77.66 U11.1 41.89,78.85 40.5,80.24 39.7,80.24 39,80.94 39,81.54 38.6,81.94 36.7,81.94 36.2,81.44 36.2,79.94 35.35,79.09 C121.2 LDO3.5 32.75,79.09 33.6,78.24 33.6,75.94 33.3,75.64 32.5,75.64 32,75.14 32,74.34 32.4,73.94 U10.2 34.3,73.94 34.9,73.34 34.9,69.24 35.9,68.24 37.6,68.24 38.99,69.64 U12.5 39.8,70.8 40.2,71.2 40.2,72 40.69,72.49 C124.2
2.5V_6
  Bottom 0.254: C134.1 44.07,59.26 U14.1 41.99,60.85 41.1,61.74 39.8,61.74 39.2,62.34 39.2,62.54 38.3,63.44 36.6,63.44 36.3,63.14 36.3,61.44 35.55,60.69 C129.2 LDO4.5 34,59.65 34,57.94 33.5,57.44 32.7,57.44 32.2,56.94 32.2,55.74 32.4,55.54 U13.2 33.8,55.54 34.8,54.54 34.8,50.94 35.6,50.14 37.8,50.14 39.09,51.44 U15.5 39.9,52.4 40.3,52.8 40.3,53.6 40.79,54.09 C132.2
2.5V_7
  Bottom 0.254: C158.1 44.17,40.86 U23.1 42.09,42.35 41,43.44 39.7,43.44 39.2,43.94 39.2,44.54 38.8,44.94 36.7,44.94 36.4,44.64 36.4,43.14 35.55,42.29 C153.2 LDO7.5 34.2,40.95 34.2,39.34 33.8,38.94 32.7,38.94 32.3,38.54 32.3,37.34 32.5,37.14 U22.2 33.8,37.14 35.2,35.74 35.2,32.64 36,31.84 37.7,31.84 39.2,33.34 U24.5 40.1,34 40.4,34.3 40.4,35.1 40.99,35.69 C156.2
2.5V_8
  Bottom 0.254: C166.1 44.07,21.36 U26.1 41.99,22.55 40.8,23.74 39.6,23.74 39,24.34 39,24.94 38.4,25.54 36.7,25.54 36.3,25.14 36.3,23.84 35.25,22.79 C161.2 LDO8.5 32.95,22.79 34.1,21.64 34.1,20.14 33.4,19.44 32.7,19.44 32.2,18.94 32.2,17.74 32.3,17.64 U25.2 34.1,17.64 35.2,16.54 35.2,12.94 35.8,12.34 37.6,12.34 39.1,13.84 U27.5 40.1,14.5 40.4,14.8 40.4,15.7 40.89,16.19 C164.2
2.5V_9
  Bottom 0.254: C174.1 67.37,77.56 U29.1 65.29,78.85 64.1,80.04 63.1,80.04 62.4,80.74 62.4,81.24 62,81.64 59.8,81.64 59.6,81.44 59.6,79.54 59.05,78.99 C169.2 LDO9.5 56.35,78.69 57.1,77.94 57.1,76.04 56.6,75.54 55.9,75.54 55.41,75.05 55.41,74.24 55.81,73.84 U28.2 57.3,73.84 58.4,72.74 58.4,69.44 59.5,68.34 61.1,68.34 62.4,69.64 U30.5 63.4,70.7 63.7,71 63.7,71.7 64.39,72.39 C172.2
2.5V_10
  Bottom 0.254: LDO10.5 56.2,60.69 | 56.2,60.69 C177.2 58.85,60.69 59.6,61.44 59.6,62.84 60.2,63.44 62.1,63.44 62.4,63.14 62.4,62.14 62.8,61.74 63.9,61.74 65.39,60.25 U32.1 67.47,59.26 C182.1 | 56.2,60.69 57.2,59.69 57.2,57.74 56.7,57.24 56,57.24 55.4,56.64 55.4,56.14 56,55.54 U31.2 57.4,55.54 58.8,54.14 58.8,50.54 59.6,49.74 61.4,49.74 62.49,50.84 U33.5 63.3,52.4 63.7,52.8 63.7,53.4 64.39,54.09 C180.2
2.5V_11
  Bottom 0.254: C206.1 67.57,40.86 U41.1 65.49,42.05 64.1,43.44 63,43.44 62.5,43.94 62.5,44.34 61.9,44.94 60.3,44.94 59.8,44.44 59.8,42.74 59.35,42.29 C201.2 LDO13.5 57.3,41.24 57.3,39.34 56.9,38.94 56.1,38.94 55.5,38.34 55.5,37.74 56.1,37.14 U40.2 57.4,37.14 58.4,36.14 58.4,33.34 59,32.74 59,31.74 59.6,31.14 61.2,31.14 62.59,32.53 U42.5 63.5,34 63.8,34.3 63.8,35 64.49,35.69 C204.2
2.5V_12
  Bottom 0.254: C214.1 67.57,22.36 U44.1 65.49,23.95 64.6,24.84 63,24.84 62.6,25.24 62.6,26.04 62.2,26.44 60.1,26.44 59.8,26.14 59.8,24.74 58.85,23.79 C209.2 LDO14.5 57.3,22.75 57.3,20.94 56.7,20.34 56,20.34 55.7,20.04 55.7,18.84 55.9,18.64 U43.2 57.5,18.64 57.8,18.34 57.8,15.04 59.1,13.74 59.1,12.34 59.4,12.04 61.8,12.04 62.6,12.84 U45.5 63.3,15.5 63.8,16 63.8,16.8 64.19,17.19 C212.2
2.5V_13
  Bottom 0.254: LDO11.5 80.5,78.99 | 80.5,78.99 C185.2 84,80.09 84,81.24 84.4,81.64 86.3,81.64 86.6,81.34 86.6,80.54 87.2,79.94 88.4,79.94 89.69,78.65 U35.1 91.77,77.56 C190.1 | 80.5,78.99 81.4,78.09 81.4,76.04 81,75.64 80.4,75.64 79.8,75.04 79.8,74.24 80.2,73.84 U34.2 81.5,73.84 83.1,72.24 83.1,68.64 83.6,68.14 85.4,68.14 86.8,69.53 U36.5 88.2,72.11 C188.2
2.5V_14
  Bottom 0.254: LDO12.5 80.6,60.59 | 80.6,60.59 C193.2 82.95,60.59 84,61.64 84,62.84 84.3,63.14 86.3,63.14 86.6,62.84 86.6,62.04 87,61.64 88.4,61.64 89.69,60.35 U38.1 91.77,59.16 C198.1 | 80.6,60.59 81.4,59.79 81.4,57.34 81.2,57.14 80.2,57.14 79.8,56.74 79.8,55.94 80.3,55.44 U37.2 81.7,55.44 82.9,54.24 82.9,50.84 83.9,49.84 85.6,49.84 86.8,51.04 U39.5 87.4,52.3 88,52.9 88,53.3 88.69,53.99 C196.2
2.5V_15
  Bottom 0.254: C222.1 91.87,40.86 U47.1 89.79,42.05 88.6,43.24 87.5,43.24 87,43.74 87,44.44 86.5,44.94 84.3,44.94 84.1,44.74 84.1,43.04 83.35,42.29 C217.2 LDO15.5 81.6,41.24 81.6,39.34 81.2,38.94 80.5,38.94 79.9,38.34 79.9,37.54 80.3,37.14 U46.2 81.7,37.14 83.1,35.74 83.1,31.94 83.7,31.34 86.3,31.34 86.89,31.93 U48.5 87.7,34 88.2,34.5 88.2,35 88.89,35.69 C220.2
2.5V_16
  Bottom 0.254: C230.1 91.87,22.56 U50.1 89.79,23.95 88.9,24.84 87.7,24.84 86.9,25.64 86.9,26.24 86.4,26.74 84.6,26.74 84.1,26.24 84.1,24.54 83.55,23.99 C225.2 LDO16.5 81.5,23.25 81.5,20.84 81.3,20.64 80.5,20.64 79.9,20.04 79.9,19.61 79.91,19.61 79.91,19.33 80.4,18.84 U49.2 81.8,18.84 82.1,18.54 82.1,16.34 83.4,15.04 83.4,12.54 83.9,12.04 86.5,12.04 86.89,12.44 U51.5 87.5,15.7 88.1,16.3 88.1,16.9 88.59,17.39 C228.2
+3V3  (via drill 0.35)  (1 unrouted)
  Top 0.254: C5.2 5.81,78.03 5.9,77.94 6.8,77.94 7.21,77.53 C1.1 7.75,77.31 IC1.5 IC1.4 | C10.2 6.01,59.43 6.1,59.34 6.9,59.34 7.31,58.93 C2.1 8.03,58.27 8.8,59.04 9.98,59.04 IC2.5 IC2.4 | IC3.4 IC3.5 9.02,40.76 8.27,40.01 C13.1 7.41,40.83 7.1,41.14 6.1,41.14 5.71,41.53 C16.2 | IC4.4 IC4.5 8.96,21.3 8.21,20.55 C19.1 7.51,21.33 7.1,21.74 6.1,21.74 5.81,22.03 C22.2 | IC5.4 IC5.5 31.89,77.31 C25.1 31.64,77.4 31.2,77.84 30.4,77.84 29.94,78.3 C28.2 | IC6.4 IC6.5 31.68,59.02 C31.1 31.64,59.2 31,59.84 30.24,59.84 C34.2 | IC7.4 IC7.5 32.38,40.76 C37.1 31.74,40.5 31.1,41.14 30.5,41.14 30.04,41.6 30.04,42.14 C40.2 | IC8.4 IC8.5 32.48,21.5 C43.1 31.74,21.4 31.3,21.84 30.3,21.84 30.04,22.1 C46.2 | IC9.4 IC9.5 58.06,77.34 56.7,77.34 56.02,76.66 C49.1 55.1,77.14 54.5,77.74 53.6,77.74 53.5,77.84 C52.2 | IC10.4 IC10.5 56.98,59.02 56.33,58.37 C55.1 55.1,58.74 54.4,59.44 53.7,59.44 53.4,59.74 C58.2 | IC11.4 IC11.5 56.81,40.66 56.27,40.11 C61.1 55.2,40.74 54.7,41.24 53.6,41.24 53.5,41.34 C64.2 | C70.2 53.5,22.94 53.7,22.74 54.7,22.74 55.2,22.24 C67.1 58.05,21.65 IC12.5 IC12.4 | IC17.4 IC17.5 82.47,21.65 C97.1 79.63,22.21 79.1,22.74 78.3,22.74 78.13,22.91 C100.2 | IC14.4 IC14.5 81.02,40.76 80.37,40.11 C79.1 79.53,40.91 79.2,41.24 78.2,41.24 77.9,41.54 77.9,42.18 C82.2 | IC16.4 IC16.5 80.88,59.02 80.23,58.37 C91.1 79.43,58.71 78.7,59.44 78.2,59.44 77.9,59.74 77.9,60.34 C94.2 | IC13.4 IC13.5 80.97,77.31 80.62,76.96 C73.1 79.43,77.51 79,77.94 77.9,77.94 77.73,78.11 C76.2
  Top 0.508: v52.52,24.74 53.47,23.79 C70.2 | v52.52,43.24 52.52,43.23 C64.2 | v52.42,61.64 52.42,61.49 C58.2 | v52.5,79.94 52.5,79.8 C52.2 | v29.03,23.74 29.88,22.89 C46.2 | v29.03,43.24 30.04,42.23 30.04,42.14 | v29.03,61.64 29.61,61.64 C34.2 | v28.83,80.04 29.67,79.2 C28.2 | v76.93,24.84 77.98,23.79 C100.2 | v76.88,43.24 77.83,42.29 C82.2 | v76.73,61.54 77.73,60.54 C94.2 | v76.78,79.94 C76.2 | v4.86,23.84 5.81,22.89 C22.2 | v4.76,43.24 4.76,43.1 C16.2 | v4.86,61.34 5.79,60.41 C10.2 | v4.66,79.84 5.6,78.9 C5.2
  Bottom 0.254: LDO.1 5.95,77.14 C87.2 | LDO2.1 6.25,58.63 C114.2 | C122.2 30.14,77.23 LDO3.1 | LDO4.1 30.3,60.55 30.3,58.79 C130.2 | LDO5.1 5.95,40.53 C138.2 | LDO6.1 6.04,21.04 C146.2 | LDO8.1 30.25,20.93 C162.2 | C154.2 30.34,40.53 LDO7.1 | LDO9.1 53.6,78.75 53.6,77.09 C170.2 | C186.2 78.1,77.39 78.1,78.83 LDO11.1 | LDO10.1 53.7,60.63 53.7,58.99 C178.2 | LDO12.1 77.94,58.84 C194.2 | LDO13.1 53.74,40.53 C202.2 | C218.2 78.05,40.44 LDO15.1 | LDO14.1 53.74,22.04 C210.2 | LDO16.3 78.4,25.89 | LDO16.1 78.25,22.23 C226.2
  Bottom 0.406: 27.8,96.4 27.8,91.2 | 53.2,92.4 53.2,96.9
  Bottom 0.508: v52.52,24.74 51.3,24.74 49.7,26.34 49.7,30.6 51.7,32.6 51.7,37.64 49.6,39.74 49.6,41.04 | v52.52,24.74 52.5,24.72 52.5,24.14 52.85,23.79 LDO14.1 | 49.6,41.04 51.8,43.24 v52.52,43.24 | v52.52,43.24 52.5,43.22 52.5,42.64 52.85,42.29 LDO13.1 | 49.6,41.04 49.6,49.44 51.6,51.44 51.6,56.44 49.6,58.44 49.6,60.74 | 49.6,60.74 50.6,61.74 52.32,61.74 v52.42,61.64 | LDO10.1 52.65,60.69 52.42,60.92 v52.42,61.64 | 49.6,60.74 49.6,67.74 51.6,69.74 51.6,74.54 49.6,76.54 49.6,79.44 | 49.6,79.44 50.2,80.04 52.4,80.04 | 52.4,80.04 v52.5,79.94 52.5,80.3 53.09,80.89 LDO9.3 | LDO9.1 52.75,78.99 52.4,79.34 52.4,80.04 | v29.03,23.74 28.43,24.34 26.5,24.34 25.9,24.94 25.9,30.34 28.2,32.64 28.2,36.44 26,38.64 26,42.44 | LDO8.1 29.55,22.79 29.03,23.31 v29.03,23.74 | v29.03,43.24 26.8,43.24 26,42.44 | LDO7.1 29.55,42.29 29.03,42.81 v29.03,43.24 | 26,42.44 26,49.44 28.1,51.54 28.1,56.34 26,58.44 26,60.74 | v29.03,61.64 26.9,61.64 26,60.74 | LDO4.1 29.46,60.69 29.43,60.73 29.41,60.73 29.03,61.11 v29.03,61.64 | 26,60.74 26,67.44 28,69.44 28,76.34 26,78.34 26,79.04 | v28.83,80.04 27,80.04 26,79.04 | v28.83,80.04 28.83,79.41 29.15,79.09 LDO3.1 | LDO16.1 77.05,23.99 76.93,24.11 v76.93,24.84 | 73.8,42.84 73.8,40.04 76.2,37.64 76.2,33.54 73.9,31.24 73.9,25.9 74.96,24.84 v76.93,24.84 | v76.88,43.24 74.2,43.24 73.8,42.84 | LDO15.1 77.05,42.29 76.88,42.46 v76.88,43.24 | 73.8,42.84 73.8,49.44 76.3,51.94 76.3,55.44 73.8,57.94 73.8,60.14 | v76.73,61.54 75.2,61.54 73.8,60.14 | LDO12.1 76.95,60.59 76.73,60.81 v76.73,61.54 | 73.8,60.14 73.8,67.94 76.1,70.24 76.1,73.84 73.9,76.04 73.9,79.54 | 73.9,79.54 74.48,80.12 76.6,80.12 v76.78,79.94
  Bottom 0.508: v4.86,23.84 2.4,23.84 2,24.24 2,42.14 | LDO6.1 5.25,22.89 4.86,23.28 v4.86,23.84 | v4.76,43.24 3.1,43.24 2,42.14 | LDO5.1 5.25,42.29 4.76,42.78 v4.76,43.24 | 2,42.14 2,51.69 1.96,51.73 1.96,60.7 | 1.96,60.7 2.6,61.34 v4.86,61.34 | LDO2.1 5.35,60.39 4.86,60.88 v4.86,61.34 | 1.96,60.7 1.96,79.4 | 1.96,79.4 2.6,80.04 4.46,80.04 v4.66,79.84 | LDO.1 5.05,78.89 4.66,79.28 v4.66,79.84 | v4.66,79.84 4.66,80.36 5.09,80.79 LDO.3 | v4.86,61.34 4.86,61.76 5.39,62.29 LDO2.3 | v4.76,43.24 4.76,43.76 5.19,44.19 LDO5.3 | v4.86,23.84 4.86,24.26 5.39,24.79 LDO6.3 | v29.03,23.74 29.03,24.23 29.5,24.7 30.23,24.7 LDO8.3 | v29.03,43.24 29.03,43.73 29.49,44.19 LDO7.3 | v29.03,61.64 29.03,62.03 29.59,62.59 LDO4.3 | v28.83,80.04 28.83,80.43 29.39,80.99 LDO3.3 | v52.42,61.64 52.42,62.32 52.7,62.6 LDO10.3 | v52.52,43.24 52.52,43.92 52.8,44.2 LDO13.3 | v52.52,24.74 52.52,25.32 52.9,25.7 LDO14.3 | LDO11.3 77.29,80.89 76.78,80.38 v76.78,79.94 | v76.73,61.54 76.73,62.23 77,62.5 77.94,62.5 LDO12.3 | v76.88,43.24 76.88,43.98 77.1,44.2 78.03,44.2 LDO15.3 | v76.93,24.84 76.93,25.53 77.29,25.89 78.4,25.89 | LDO11.1 77.01,78.99 76.78,79.22 v76.78,79.94 | 73.9,79.54 73.9,83.2 68.6,88.5 68.6,93.47 J7.1 69.57,95.73 67.1,98.2 54.5,98.2 53.2,96.9 | 1.96,79.4 1.96,86.07 6.09,90.2 6.6,90.2 9.73,93.33 9.73,94.1 J2.1 13.73,98.1 26.1,98.1 27.8,96.4 | 27.8,91.2 26,89.4 26,79.04 | 49.6,79.44 49.6,88.8 53.2,92.4
DDS1_OUT  (via drill 0.35)
  Top 0.254: SJ2.2 SJ1.2 16.86,69.28 v16.9,69.24
  Bottom 0.254: R57.1 17.8,74.44 17.98,74.26 17.98,69.82 17.39,69.24 v16.9,69.24
DDS2_OUT  (via drill 0.35)
  Top 0.254: SJ8.2 SJ6.2 16.86,50.98 v17.1,50.74
  Bottom 0.254: R59.1 18,55.94 18.2,55.74 18.2,51.44 17.5,50.74 v17.1,50.74
DDS3_OUT  (via drill 0.35)
  Top 0.254: SJ14.2 SJ13.2 17.16,32.28 v17.2,32.24
  Bottom 0.254: R70.1 18.3,37.09 18.3,33.04 17.5,32.24 v17.2,32.24
DDS4_OUT  (via drill 0.35)
  Top 0.254: SJ20.2 SJ19.2 17.16,13 v17.1,12.94
  Bottom 0.254: R71.1 18.3,17.79 18.3,13.84 17.4,12.94 v17.1,12.94
DDS5_OUT  (via drill 0.35)
  Top 0.254: SJ26.2 SJ25.2 v40.89,69.05 v40.9,69.04
  Bottom 0.254: R60.1 42.4,73.99 42.4,69.74 41.7,69.04 v40.9,69.04
DDS6_OUT  (via drill 0.35)
  Top 0.254: SJ32.2 SJ31.2 v41.19,50.85 v41.2,50.84
  Bottom 0.254: R69.1 42.3,56.24 42.7,55.84 42.7,52.74 42.7,51.64 41.9,50.84 v41.2,50.84
DDS7_OUT  (via drill 0.35)
  Top 0.254: SJ38.2 SJ37.2 v41.29,32.25 v41.3,32.24
  Bottom 0.254: R72.1 42.7,37.09 42.7,33.74 42.7,32.94 42,32.24 v41.3,32.24
DDS8_OUT  (via drill 0.35)
  Top 0.254: SJ44.2 SJ43.2 v41.39,12.85 v41.4,12.84
  Bottom 0.254: R73.1 42.5,17.69 42.5,13.84 41.5,12.84 v41.4,12.84
DDS9_OUT  (via drill 0.35)
  Top 0.254: SJ50.2 SJ49.2 64.55,69.05 v64.6,69
  Bottom 0.254: R74.1 65.9,73.79 65.9,69.64 65.26,69 v64.6,69
DDS10_OUT  (via drill 0.35)
  Top 0.254: SJ56.2 SJ55.2 64.65,50.99 v64.7,50.94
  Bottom 0.254: v64.7,50.94 65.6,50.94 65.9,51.24 65.9,55.59 R75.1
DDS11_OUT  (via drill 0.35)
  Top 0.254: SJ62.2 SJ61.2 64.8,33.75 v64.8,32.34
  Bottom 0.254: v64.8,32.34 65.6,32.34 66.1,32.84 66.1,37.09 R78.1
DDS12_OUT  (via drill 0.35)
  Top 0.254: SJ68.2 SJ67.2 64.85,12.99 v64.8,12.94
  Bottom 0.254: v64.8,12.94 65.6,12.94 66.1,13.44 66.1,18.59 R79.1
DDS13_OUT  (via drill 0.35)
  Top 0.254: SJ74.2 SJ73.2 88.98,69.06 v89,69.04
  Bottom 0.254: v89,69.04 89.8,69.04 90.2,69.44 90.2,73.89 R76.1
DDS14_OUT  (via drill 0.35)
  Top 0.254: v88.7,50.94 88.68,50.96 SJ91.2 SJ92.2
  Bottom 0.254: v88.7,50.94 89.6,50.94 90.2,51.54 90.2,55.49 R77.1
DDS15_OUT  (via drill 0.35)
  Top 0.254: SJ80.2 SJ79.2 88.88,32.36 v88.9,32.34
  Bottom 0.254: v88.9,32.34 89.8,32.34 90.4,32.94 90.4,37.24 89.8,37.84 R80.1
DDS16_OUT  (via drill 0.35)
  Top 0.254: SJ98.2 SJ97.2 89,14.42 v89,13.13
  Bottom 0.254: v89,13.13 89.99,13.13 90.4,13.54 90.4,18.79 R81.1
DIN_2_A  (via drill 0.35)
  Top 0.254: v18.1,85.95 16.07,85.95 v16.04,85.98 | v19.9,65.64 20.69,65.64 v21.44,64.9 | v20.2,47.44 20.2,46.34 20.4,46.14 21,46.14 v21.9,47.04
  Bottom 0.254: U3.8 16.4,85.44 16.04,85.8 v16.04,85.98 | U8.8 16.48,63.35 16.48,64.32 18.29,66.13 19.41,66.13 v19.9,65.64 19.9,65.83 20.2,66.13 23.27,66.13 26.91,69.77 26.91,74.91 24.61,77.21 24.61,83.16 21.87,85.9 18.15,85.9 v18.1,85.95 18.1,87.55 23.74,93.19 J2.12 | v21.44,64.9 21.72,64.9 22.61,64.01 22.61,59.31 26.76,55.15 26.76,52.83 22.17,48.23 20.3,48.23 | U17.8 16.7,46.77 18.17,48.23 20.3,48.23 | 20.3,48.23 20.3,47.54 v20.2,47.44 | v21.9,47.04 22.38,47.04 23.21,46.21 23.21,39.48 26.91,35.78 26.91,34.2 21.24,28.53 17.79,28.53 16.8,27.54 U20.8
DIN_2_B  (via drill 0.35)
  Top 0.254: v44.1,65.61 44.65,65.06 v45.6,65.06 | v45.7,46.9 44.74,46.9 v44.16,47.48 | v39.5,86.34 41.5,86.34 v41.5,86.44
  Bottom 0.254: U14.8 41,64.86 42.37,66.23 44.1,66.23 | 44.1,66.23 46.37,66.23 50.56,70.43 50.56,73.45 46.71,77.31 46.71,83.31 43.58,86.44 v41.5,86.44 | 44.1,66.23 v44.1,65.61 | v45.6,65.06 45.65,65.11 46.31,65.11 47.11,64.31 47.11,59.28 50.61,55.78 50.61,52.5 46.24,48.13 44.1,48.13 | U23.8 41.1,46.49 42.74,48.13 44.1,48.13 | 44.1,48.13 44.1,47.54 v44.16,47.48 | v45.7,46.9 46.72,46.9 47.91,45.71 47.91,39.68 50.61,36.98 50.61,33.1 46.44,28.93 42.74,28.93 41,27.19 U26.8 | U11.8 40.9,85.34 39.9,86.34 v39.5,86.34 39.4,86.44 39.4,88.01 43.04,91.65 J4.10
DIN_2_C  (via drill 0.35)
  Top 0.254: v68.1,65.54 68.1,65.04 68.5,64.64 69.45,64.64 v69.75,64.94 | v68.4,47.44 69.1,46.74 v70.1,46.74 | v63.1,86.84 65.2,86.84 v65.3,86.74
  Bottom 0.254: U32.8 64.4,65.56 64.97,66.13 68,66.13 | 68,66.13 69.97,66.13 74.81,70.97 74.81,72.91 70.81,76.91 70.81,84.33 68.4,86.74 v65.3,86.74 | 68,66.13 68.1,66.03 v68.1,65.54 | v69.75,64.94 71.21,63.48 71.21,58.81 74.81,55.21 74.81,52.87 70.07,48.13 68.4,48.13 | U41.8 64.5,47.56 65.07,48.13 68.4,48.13 | 68.4,48.13 v68.4,47.44 | v70.1,46.74 70.8,46.74 71.91,45.63 71.91,39.61 74.81,36.71 74.81,34.27 69.57,29.03 65.42,29.03 64.58,28.18 64.58,26.8 U44.8 | U29.8 64.3,85.74 63.2,86.84 v63.1,86.84 62,87.94 62,93.19 J1.10
DIN_2_D  (via drill 0.35)
  Top 0.254: v92.2,47.44 92.9,46.74 93.6,46.74 v94,46.34 | v92.1,65.44 92.1,64.94 92.4,64.64 93.5,64.64 v93.7,64.84 | v87.5,86.84 v89.3,86.84
  Bottom 0.254: U50.8 88.8,28.31 89.53,29.03 93.57,29.03 98.26,33.72 98.26,37.15 95.21,40.21 95.21,45.31 94.17,46.34 v94,46.34 | U47.8 88.8,47.56 89.37,48.13 92.2,48.13 | 92.2,48.13 93.87,48.13 98.26,52.53 98.26,55.66 94.81,59.11 94.81,63.73 v93.7,64.84 | 92.2,48.13 v92.2,47.44 | U38.8 88.7,65.29 89.54,66.13 92.1,66.13 | 92.1,66.13 93.94,66.13 98.31,70.5 98.31,73.68 94.81,77.18 94.81,83.31 91.28,86.84 v89.3,86.84 | 92.1,66.13 v92.1,65.44 | U35.8 88.7,85.74 87.6,86.84 v87.5,86.84 87.36,86.84 83.53,90.67 83.53,93.16 J7.12
FILTER1  (via drill 0.35)
  Top 0.254: C7.1 R3.2 20.36,78.52 SJ4.2 20.36,82.3 v20.4,82.34 | SJ5.2 12.11,70.53 14.1,68.54 17.7,68.54 18.4,69.24 18.4,71.04 18.64,71.28 v18.64,71.36 17.82,72.17 SJ1.1
  Bottom 0.254: v20.4,82.34 21.6,81.14 21.6,77.44 18.64,74.48 v18.64,71.36
FILTER2  (via drill 0.35)
  Top 0.254: C12.1 R8.2 20.15,60.37 20.15,62.4 SJ11.2 21.47,62.41 v21.5,62.44 | SJ12.2 12.31,52.13 14.4,50.04 17.6,50.04 18.4,50.84 18.4,53.05 v18.85,53.51 17.14,53.51 SJ6.1
  Bottom 0.254: v18.85,53.51 18.85,55.09 21.6,57.84 21.6,62.34 v21.5,62.44
FILTER3  (via drill 0.35)
  Top 0.254: C18.1 R12.2 20.55,44.06 SJ17.2 20.95,44.64 v21.9,44.64 | SJ18.2 12.41,33.43 14.5,31.34 17.6,31.34 18.5,32.24 18.5,33.74 18.5,34.44 v19,34.94 18.7,35.24 18.53,35.24 18.44,35.32 SJ13.1
  Bottom 0.254: v19,34.94 19,36.04 21.9,38.94 v21.9,44.64
FILTER4  (via drill 0.35)
  Top 0.254: C24.1 R16.2 20.65,24.7 SJ23.2 21.95,24.79 v22.1,24.94 | SJ24.2 12.51,14.33 14.6,12.24 17.8,12.24 18.4,12.84 18.4,15.94 19.1,16.64 v19.1,16.74 18.4,16.04 17.18,16.04 SJ19.1
  Bottom 0.254: v19.1,16.74 22.1,19.74 v22.1,24.94
FILTER5  (via drill 0.35)
  Top 0.254: C30.1 R20.2 44.29,78.72 SJ29.2 44.29,81.75 v43.6,82.44 | SJ30.2 36.74,69.95 36.74,69.9 38.3,68.34 41.9,68.34 42.5,68.94 42.5,71.38 v43.06,71.94 40.92,71.94 SJ25.1
  Bottom 0.254: v43.06,71.94 43.06,74.1 44.5,75.54 45,75.54 45.7,76.24 45.7,81.54 44.8,82.44 v43.6,82.44
FILTER6  (via drill 0.35)
  Top 0.254: C36.1 R24.2 44.08,62.72 | 44.08,62.72 SJ35.2 | SJ36.2 36.44,52.1 38.4,50.14 41.9,50.14 42.5,50.74 42.5,52.83 v43.36,53.68 41.29,53.68 SJ31.1 | v45.5,62.84 44.2,62.84 44.08,62.72
  Bottom 0.254: v43.36,53.68 43.36,53.88 43.2,54.04 43.2,55.74 45.5,58.04 v45.5,62.84
FILTER7  (via drill 0.35)
  Top 0.254: C42.1 R28.2 44.18,44.46 SJ41.2 44.1,44.54 v45.7,44.54 | SJ42.2 38.8,31.54 42.1,31.54 42.6,32.04 42.6,33.98 v43.36,34.74 42.78,35.32 SJ37.1
  Bottom 0.254: v43.36,34.74 43.36,37 45.7,39.34 v45.7,44.54
FILTER8  (via drill 0.35)
  Top 0.254: SJ48.2 36.7,14.44 39,12.14 41.7,12.14 42.6,13.04 42.6,16.14 43.45,16.99 | 43.45,16.99 v43.5,17.04 | v45.8,25.24 44.24,25.24 SJ47.2 44.28,25.2 R32.2 C48.1 | SJ43.1 41.39,16.93 41.7,17.24 43.2,17.24 43.45,16.99
  Bottom 0.254: v43.5,17.04 45.8,19.34 v45.8,25.24
FILTER9  (via drill 0.35)
  Top 0.254: C54.1 68.26,78.91 R36.2 68.15,79.02 SJ53.2 68.15,82.15 v68.64,82.64 | SJ54.2 60.5,70.05 60.5,69.64 61.9,68.24 65.2,68.24 66.6,69.64 66.6,71.31 v66.58,71.33 66.48,71.33 65.84,71.97 SJ49.1
  Bottom 0.254: v66.58,71.33 66.58,72.83 69.8,76.04 69.8,81.48 v68.64,82.64
FILTER10  (via drill 0.35)
  Top 0.254: C60.1 R40.2 68.24,62.52 SJ59.2 69.43,62.61 v69.7,62.34 | SJ60.2 62.28,50.18 65.9,50.18 66.4,50.68 66.4,53.04 v66.6,53.24 66.2,53.24 65.66,53.78 SJ55.1
  Bottom 0.254: v66.6,53.24 66.6,54.64 69.9,57.94 69.9,62.14 v69.7,62.34
FILTER11  (via drill 0.35)
  Top 0.254: C66.1 R44.2 68.34,44.46 SJ65.2 68.46,44.34 v69.7,44.34 | SJ66.2 61.2,32.9 61.2,32.44 62.2,31.44 65.4,31.44 66.7,32.74 66.7,33.74 66.76,33.8 v66.76,34.47 65.9,35.32 SJ61.1
  Bottom 0.254: v66.76,34.47 66.76,36.4 69.7,39.34 v69.7,44.34
FILTER12  (via drill 0.35)
  Top 0.254: C72.1 R48.2 68.25,23.44 SJ71.2 69.65,25.59 v69.7,25.64 | SJ72.2 60.8,14.04 60.8,13.44 62,12.24 65.7,12.24 66.6,13.14 66.6,16.24 v66.9,16.54 66.32,15.96 SJ67.1
  Bottom 0.254: v66.9,16.54 69.7,19.34 v69.7,25.64
FILTER13  (via drill 0.35)
  Top 0.254: C78.1 92.17,77.02 R52.2 92.17,81.21 SJ77.2 92.74,81.96 v92.74,83.04 | SJ78.2 86.44,68.34 89.8,68.34 90.7,69.24 90.7,70.74 90.86,70.9 v90.86,71.38 90.4,71.84 89.11,71.84 SJ73.1
  Bottom 0.254: v90.86,71.38 90.86,73.6 93.3,76.04 93.3,82.48 v92.74,83.04
FILTER14  (via drill 0.35)
  Top 0.254: C96.1 92.17,58.31 R64.2 92.17,62.52 SJ95.2 92.45,62.24 v93.5,62.24 | SJ96.2 85.1,51.49 85.1,51.14 86,50.24 89.7,50.24 90.3,50.84 90.3,52.83 v90.86,53.38 90.36,53.38 89.96,53.78 SJ91.1
  Bottom 0.254: v90.86,53.38 90.86,55.1 93.5,57.74 v93.5,62.24
FILTER15  (via drill 0.35)
  Top 0.254: C84.1 92.27,40.17 R56.2 92.27,44.26 SJ83.2 92.49,44.04 v93.7,44.04 | SJ84.2 85,33.23 85,33.04 86.5,31.54 89.6,31.54 90.5,32.44 90.5,34.08 v91.06,34.64 90.38,35.32 SJ79.1
  Bottom 0.254: v91.06,34.64 91.06,36.6 93.7,39.24 v93.7,44.04
FILTER16  (via drill 0.35)
  Top 0.254: C102.1 92.33,23.51 R68.2 92.28,23.64 SJ101.2 93.65,25.79 v93.7,25.84 | SJ102.2 85.4,13.57 85.4,13.14 86.1,12.44 89.9,12.44 90.4,12.94 90.4,16.04 v91.2,16.84 89.86,16.84 SJ97.1
  Bottom 0.254: v91.2,16.84 93.7,19.34 v93.7,25.84
FSELECT_A  (via drill 0.35)
  Top 0.254: v2.75,70.67 2.75,54.11 v2.76,54.1 3.52,53.34 7,53.34 8.71,55.05 8.71,55.74 9.38,56.41 IC2.9 | v2.75,52.05 2.65,51.95 2.65,36.04 v2.85,35.84 3.65,35.04 6.9,35.04 8.91,37.05 8.91,37.94 9.12,38.16 IC3.9 | v2.85,33.71 2.75,33.61 2.75,17.89 4.1,16.54 7.92,16.54 9,17.61 9,18.44 9.26,18.7 IC4.9 | IC1.9 9.37,74.7 8.6,73.94 8.6,73.52 8.19,73.11 8.19,73.03 7.67,72.51 v3.02,72.51 2.82,72.51 2.59,72.73 2.59,84.19 5.7,87.3 10.8,87.3 12.7,89.2 12.7,94.53 J2.3
  Bottom 0.254: v3.02,72.51 3.02,70.94 v2.75,70.67 | v2.76,54.1 2.76,52.07 v2.75,52.05 | v2.85,35.84 v2.85,33.71
FSELECT_B  (via drill 0.35)
  Top 0.254: v27.02,28.5 26.91,28.39 26.91,18.03 28,16.95 32.61,16.95 33.3,17.64 33.3,18.74 33.45,18.89 IC8.9 | v27.02,47.08 26.91,46.98 26.91,30.04 v27.02,29.94 28.9,29.94 32,33.04 32,35.84 33.2,37.04 33.2,37.74 33.62,38.16 IC7.9 | v27.11,65.78 26.91,65.58 26.91,48.54 v27.02,48.44 27.21,48.24 30.12,48.24 30.59,48.71 30.59,52.93 33.2,55.54 33.2,56.04 33.58,56.41 IC6.9 | IC5.9 33.56,74.7 33.2,74.34 33.2,73.92 30.99,71.71 30.99,67.64 30.25,66.9 27.21,66.9 v27.02,67.1 26.82,67.3 26.82,87.72 31.4,92.3 31.4,94.3 32.83,95.73 J4.1
  Bottom 0.254: v27.02,29.94 v27.02,28.5 | v27.02,48.44 v27.02,47.08 | v27.02,67.1 27.11,67.1 v27.11,65.78
FSELECT_C  (via drill 0.35)
  Top 0.254: v50.66,28.48 50.14,27.96 50.14,18.8 51.3,17.64 55.7,17.64 56.95,18.89 IC12.9 | v50.76,47.78 50.4,47.42 50.4,38.34 50.66,38.08 v50.66,29.94 53.73,29.94 54.79,31.01 54.79,35.23 57.62,38.05 IC11.9 | v50.96,66.28 50.36,65.68 50.36,57.74 50.76,57.34 v50.76,49.14 50.96,48.94 54.23,48.94 54.79,49.51 54.79,53.63 57.58,56.41 IC10.9 | IC9.9 57.56,74.7 54.69,71.83 54.69,68.14 53.99,67.44 51.16,67.44 v50.96,67.64 50.96,73.44 50.36,74.04 50.36,94.29 51.8,95.73 J1.1
  Bottom 0.254: v50.66,29.94 v50.66,28.48 | v50.76,49.14 v50.76,47.78 | v50.96,66.28 v50.96,67.64
FSELECT_D  (via drill 0.35)
  Top 0.254: v75.02,28.78 74.92,28.68 74.92,18.93 76.1,17.75 80.51,17.75 81.75,19 IC17.9 | v75.02,65.58 74.61,65.18 74.61,57.38 74.92,57.07 v74.92,48.64 74.92,48.43 78.42,48.43 78.89,48.91 78.89,53.31 81.2,55.62 81.2,56.14 81.47,56.41 IC16.9 | IC14.9 81.52,38.16 81.3,37.94 81.3,37.24 79.56,35.5 79.56,32.34 77.16,29.94 75.22,29.94 v75.02,30.14 74.76,30.39 74.76,47.09 v74.92,47.24 | IC13.9 81.47,74.7 81.1,74.34 81.1,73.81 79.03,71.75 79.03,67.25 78.53,66.74 75.22,66.74 v75.02,66.94 74.72,67.24 74.72,94.44 73.43,95.73 J7.3
  Bottom 0.254: v75.02,30.14 v75.02,28.78 | v74.92,48.64 v74.92,47.24 | v75.02,66.94 v75.02,65.58
FSYNC1  (via drill 0.35)
  Top 0.254: IC1.15 16.59,76.66 18.2,75.04 21.1,75.04 21.6,75.54 21.6,82.14 v20.4,83.34 20.4,90.1 17.7,92.8 17.7,94.47 J2.5
  Bottom 0.254: U3.10 17.39,82.73 18,83.34 v20.4,83.34
FSYNC2  (via drill 0.35)
  Top 0.254: IC2.15 16.77,58.37 18.4,56.74 21,56.74 22.2,57.94 22.2,63.54 | v21.5,63.54 22.2,63.54 | 22.2,63.54 22.2,89.07 18.98,92.29 J2.8
  Bottom 0.254: U8.10 17.71,63.54 v21.5,63.54
FSYNC3  (via drill 0.35)
  Top 0.254: IC3.15 16.64,40.1 18.5,38.24 21.5,38.24 22.61,39.35 22.61,45.54 | 22.61,45.54 22.51,45.64 v21.9,45.64 | 22.61,45.54 22.61,89.29 20.3,91.6 20.3,94.89 J2.7
  Bottom 0.254: v21.9,45.64 21.1,44.84 19.6,44.84 18.6,45.84 17.91,45.84 17.69,45.62 U17.10
FSYNC4  (via drill 0.35)
  Top 0.254: IC4.15 16.8,20.64 18.2,19.24 21.8,19.24 23.02,20.46 23.02,26.74 | v22.1,26.74 23.02,26.74 | 23.02,26.74 23.02,89.48 21.5,91 21.5,93.17 J2.10
  Bottom 0.254: U20.10 17.79,26.52 18.31,27.04 21.8,27.04 v22.1,26.74
FSYNC5  (via drill 0.35)
  Top 0.254: IC5.15 40.98,76.66 42.2,75.44 44.9,75.44 45.5,76.04 45.5,82.44 v44.6,83.34 44.56,83.38 44.56,85.02 36.7,92.88 36.7,94.58 35.85,95.3 J4.3
  Bottom 0.254: U11.10 41.89,82.83 42.4,83.34 v44.6,83.34
FSYNC6  (via drill 0.35)
  Top 0.254: IC6.15 40.77,58.37 41.8,57.34 44.8,57.34 46.3,58.84 46.3,63.74 | v45.5,63.75 v45.51,63.74 46.3,63.74 | 46.3,63.74 46.3,83.9 38.2,92 38.2,93.18 J4.6
  Bottom 0.254: v45.5,63.75 45.39,63.64 42.01,63.64 U14.10
FSYNC7  (via drill 0.35)
  Top 0.254: IC7.15 40.94,40.1 41.9,39.14 44.8,39.14 46.71,41.05 46.71,45.54 | v45.7,45.54 46.71,45.54 | J4.5 39.3,94.61 39.3,91.5 46.71,84.09 46.71,45.54
  Bottom 0.254: U23.10 42.09,45.44 45.6,45.44 v45.7,45.54
FSYNC8  (via drill 0.35)
  Top 0.254: IC8.15 40.9,20.84 42.1,19.64 44.8,19.64 47.12,21.96 47.12,26.84 | v45.8,26.84 47.12,26.84 | J4.8 40.5,90.94 47.12,84.32 47.12,26.84
  Bottom 0.254: U26.10 41.99,26.73 42.1,26.84 v45.8,26.84
FSYNC9  (via drill 0.35)
  Top 0.254: IC9.15 64.78,76.66 66.1,75.34 69.3,75.34 69.6,75.64 69.6,82.64 v68.6,83.64 67.34,84.9 62.7,84.9 55.7,91.9 55.7,94.45 J1.3
  Bottom 0.254: U29.10 65.29,82.83 66.1,83.64 v68.6,83.64
FSYNC10  (via drill 0.35)
  Top 0.254: IC10.15 64.58,58.37 65.8,57.14 69.5,57.14 70.4,58.04 70.4,63.25 | v69.7,63.25 70.4,63.25 | 70.4,63.25 70.4,83.41 65.02,88.8 59.6,88.8 56.96,91.44 J1.6
  Bottom 0.254: U32.10 65.79,63.22 69.68,63.22 v69.7,63.25
FSYNC11  (via drill 0.35)